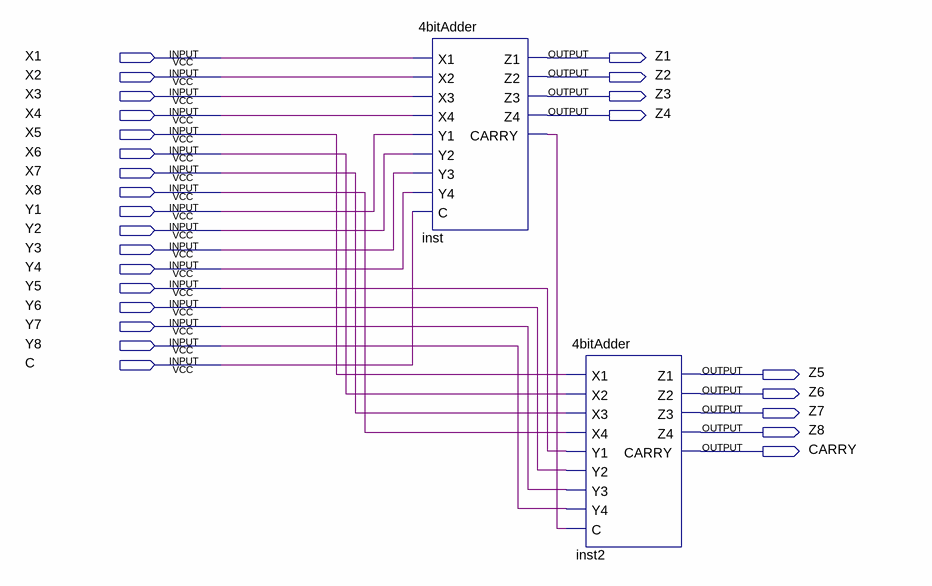
[diagram p0: schematic sheet]
// Quartus schematic 8bitAdder.bdf as structural Verilog: 2 symbols, 26 pins
module \8bitAdder  (
  input  X1,
  input  X2,
  input  X3,
  input  X4,
  input  X5,
  input  X6,
  input  X7,
  input  X8,
  input  Y1,
  input  Y2,
  input  Y3,
  input  Y4,
  input  Y5,
  input  Y6,
  input  Y7,
  input  Y8,
  input  C,
  output Z1,
  output Z2,
  output Z3,
  output Z4,
  output Z5,
  output Z6,
  output Z7,
  output Z8,
  output CARRY
);

  wire inst_carry;

  \4bitAdder  inst (
    .X1(X1), .X2(X2), .X3(X3), .X4(X4), .Y1(Y1), .Y2(Y2), .Y3(Y3), .Y4(Y4), .C(C), .Z1(Z1), .Z2(Z2), .Z3(Z3),
    .Z4(Z4), .CARRY(inst_carry));
  \4bitAdder  inst2 (
    .X1(X5), .X2(X6), .X3(X7), .X4(X8), .Y1(Y5), .Y2(Y6), .Y3(Y7), .Y4(Y8), .C(inst_carry), .Z1(Z5), .Z2(Z6),
    .Z3(Z7), .Z4(Z8), .CARRY(CARRY));
endmodule
